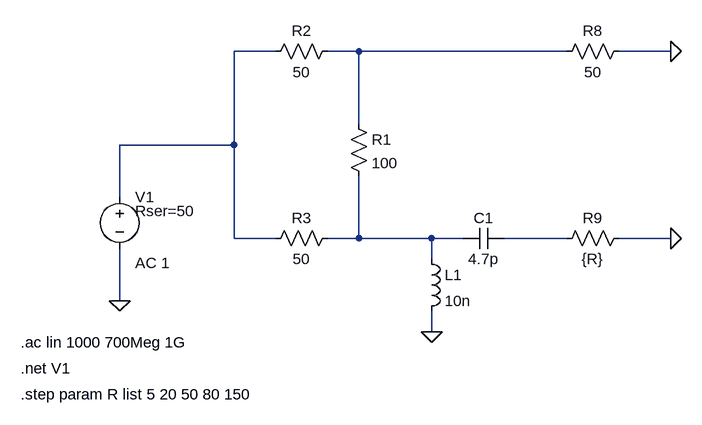
[diagram p0: schematic reflection_modulator.asc]
reflection_modulator.asc, the LTspice schematic file:
Version 4
SHEET 1 1264 680
WIRE 208 112 144 112
WIRE 336 112 288 112
WIRE 656 112 336 112
WIRE 816 112 736 112
WIRE 336 224 336 112
WIRE 144 256 144 112
WIRE 144 256 -32 256
WIRE -32 336 -32 256
WIRE 144 400 144 256
WIRE 208 400 144 400
WIRE 336 400 336 304
WIRE 336 400 288 400
WIRE 448 400 336 400
WIRE 496 400 448 400
WIRE 656 400 560 400
WIRE 816 400 736 400
WIRE 448 432 448 400
WIRE -32 496 -32 416
WIRE 448 544 448 512
FLAG -32 496 0
FLAG 816 400 0
FLAG 816 112 0
FLAG 448 544 0
SYMBOL voltage -32 320 R0
WINDOW 123 24 118 Left 2
WINDOW 39 24 38 Left 2
SYMATTR Value2 AC 1
SYMATTR SpiceLine Rser=50
SYMATTR InstName V1
SYMATTR Value ""
SYMBOL res 320 208 R0
SYMATTR InstName R1
SYMATTR Value 100
SYMBOL res 304 96 R90
WINDOW 0 0 56 VBottom 2
WINDOW 3 32 56 VTop 2
SYMATTR InstName R2
SYMATTR Value 50
SYMBOL res 304 384 R90
WINDOW 0 0 56 VBottom 2
WINDOW 3 32 56 VTop 2
SYMATTR InstName R3
SYMATTR Value 50
SYMBOL res 752 96 R90
WINDOW 0 0 56 VBottom 2
WINDOW 3 32 56 VTop 2
SYMATTR InstName R8
SYMATTR Value 50
SYMBOL res 752 384 R90
WINDOW 0 0 56 VBottom 2
WINDOW 3 32 56 VTop 2
SYMATTR InstName R9
SYMATTR Value {R}
SYMBOL ind 432 416 R0
SYMATTR InstName L1
SYMATTR Value 10n
SYMBOL cap 560 384 R90
WINDOW 0 0 32 VBottom 2
WINDOW 3 32 32 VTop 2
SYMATTR InstName C1
SYMATTR Value 4.7p
TEXT -184 560 Left 2 !.ac lin 1000 700Meg 1G
TEXT -184 600 Left 2 !.net V1
TEXT -184 640 Left 2 !.step param R list 5 20 50 80 150

The netlist it stands for:
* reflection_modulator.asc
V1 N001 0 AC 1 Rser=50
R1 N002 N003 100
R2 N002 N001 50
R3 N003 N001 50
R8 0 N002 50
R9 0 N004 {R}
L1 N003 0 10n
C1 N004 N003 4.7p
.ac lin 1000 700Meg 1G
.net V1
.step param R list 5 20 50 80 150
.backanno
.end